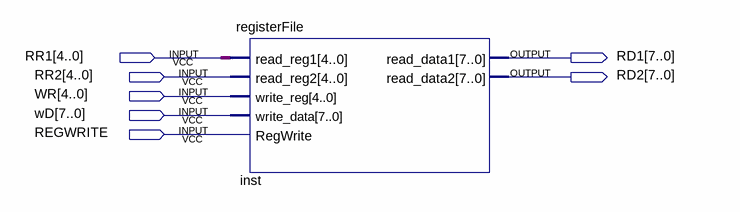
[diagram p0: schematic sheet]
// Quartus schematic TEST.bdf as structural Verilog: 1 symbols, 7 pins
module TEST (
  input  [4:0] RR1,
  input  [4:0] RR2,
  input  [4:0] WR,
  input  [7:0] wD,
  input  REGWRITE,
  output [7:0] RD1,
  output [7:0] RD2
);

  registerFile inst (
    .read_reg1(RR1), .read_reg2(RR2), .write_reg(WR), .write_data(wD), .RegWrite(REGWRITE), .read_data1(RD1),
    .read_data2(RD2));
endmodule
